# EAGLE design e4e_sleep_timer (EAGLE 9.6.2)

## Sheet 1 of 2
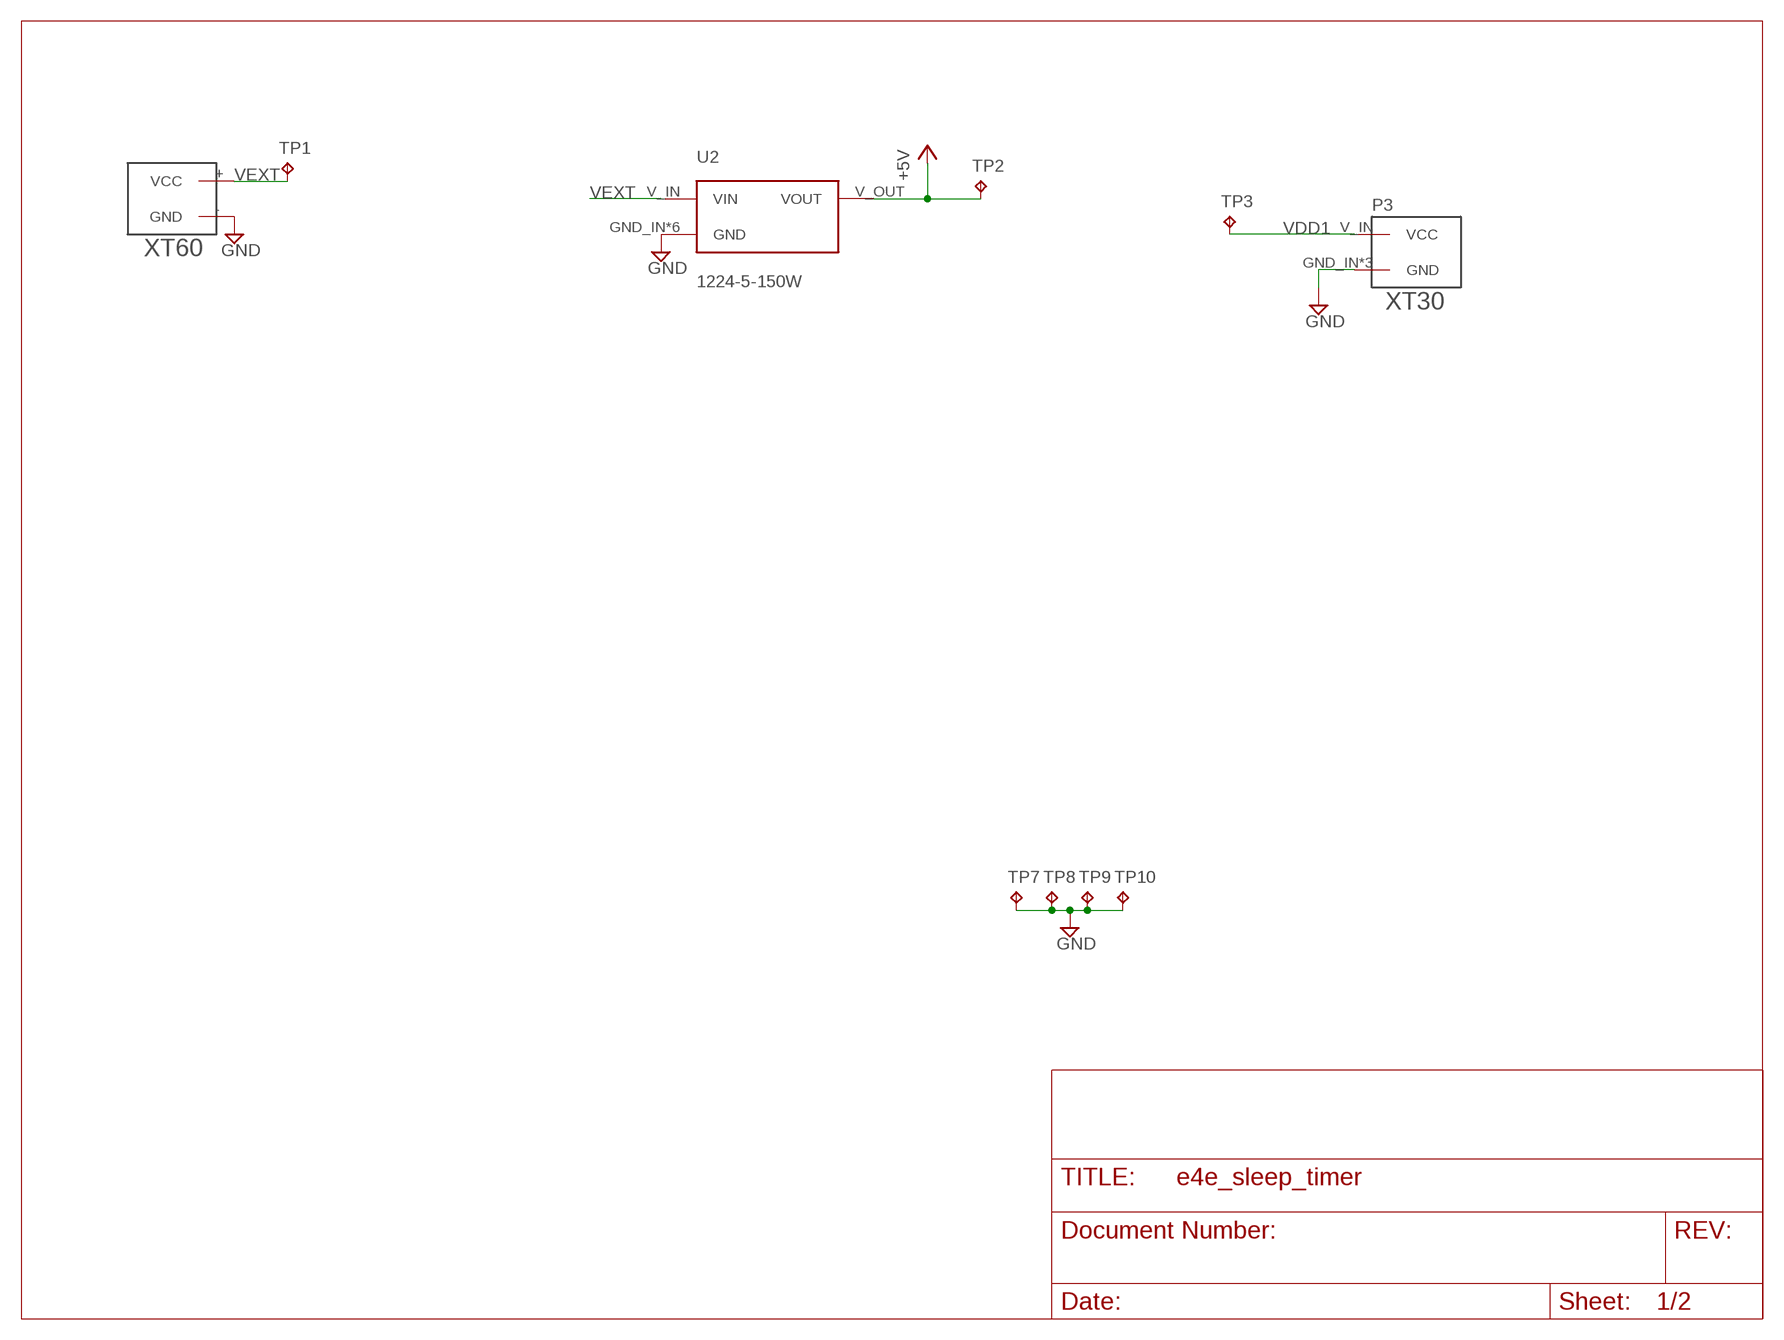
[diagram p0: schematic, sheet 1]

### Parts
P1  XT60  [XT60]
P3  XT30PW-F  [XT30PW-F]
TP1  TPPAD1-13  [P1-13]
TP2  TPPAD1-13  [P1-13]
TP3  TPPAD1-13  [P1-13]
TP7  TPPAD1-13  [P1-13]
TP8  TPPAD1-13  [P1-13]
TP9  TPPAD1-13  [P1-13]
TP10  TPPAD1-13  [P1-13]
U2  1224-5-150W  [2X_XT30]

### Nets
+5V: TP2.TP U2.V_OUT(VOUT) ; also sheet 2
GND: P1.-(GND) P3.GND_IN(GND) P3.S1(GND) P3.S2(GND) TP7.TP TP8.TP TP9.TP TP10.TP U2.GND_IN(GND) U2.GND_OUT(GND) U2.S1(GND) U2.S2(GND) U2.S3(GND) U2.S4(GND) ; also sheet 2
VDD1: P3.V_IN(VCC) TP3.TP ; also sheet 2
VEXT: P1.+(VCC) TP1.TP U2.V_IN(VIN)

## Sheet 2 of 2
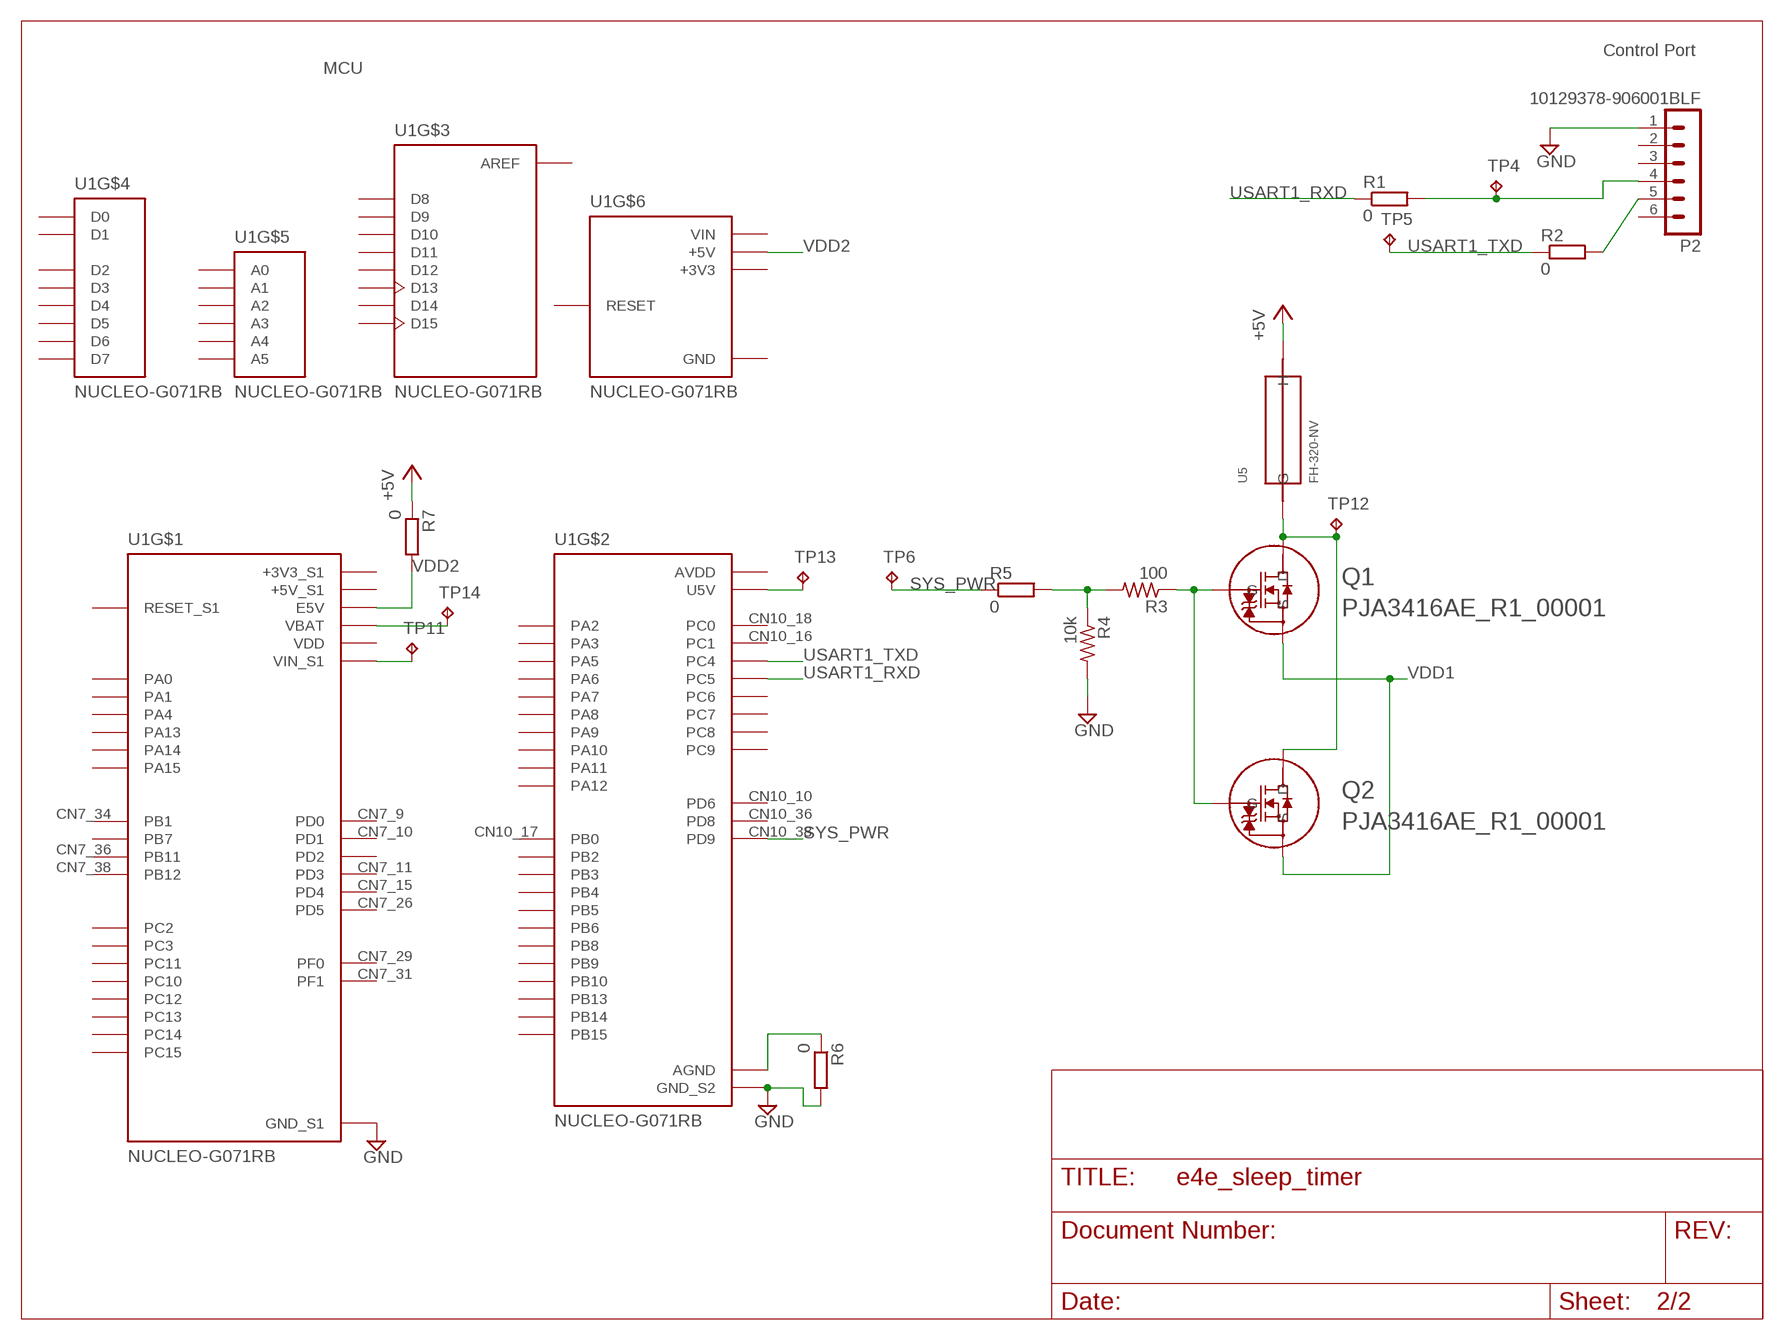
[diagram p1: schematic, sheet 2]

### Parts
P2  10129378-906001BLF  MA06-1  [MA06-1]
Q1  PJA3416AE_R1_00001  [SOT23_PJA3416_PNJ]
Q2  PJA3416AE_R1_00001  [SOT23_PJA3416_PNJ]
R1  0  R-EU_R0603  [R0603]
R2  0  R-EU_R0603  [R0603]
R3  100  R-US_R0603  [R0603]
R4  10k  R-US_R0603  [R0603]
R5  0  R-EU_R0603  [R0603]
R6  0  R-EU_R0603  [R0603]
R7  0  R-EU_R0603  [R0603]
TP4  TPPAD1-13  [P1-13]
TP5  TPPAD1-13  [P1-13]
TP6  TPPAD1-13  [P1-13]
TP11  TPTP20R  [TP20R]
TP12  TPTP20R  [TP20R]
TP13  TPTP20R  [TP20R]
TP14  TPTP20R  [TP20R]
U1  NUCLEO-G071RB  [ST_NUCLEO-64]
U5  FH-320-NV  [FH-320-NV]

### Nets
+5V: R7.1 U5.2(H) ; also sheet 1
GND: P2.1 R4.2 R6.2 U1.CN7_8(GND_S1) U1.CN7_19(GND_S1) U1.CN7_20(GND_S1) U1.CN7_22(GND_S1) U1.CN10_20(GND_S2) ; also sheet 1
N$1: P2.4 R1.2 TP4.TP
N$2: Q1.1(G) Q2.1(G) R3.1
N$3: P2.5 R2.2
N$4: R3.2 R4.1 R5.2
N$5: Q1.3(D) Q2.3(D) TP12.TP U5.1(G)
N$6: TP11.TP U1.CN7_24(VIN_S1)
N$7: R6.1 U1.CN10_9(AGND) U1.CN10_32(AGND)
N$8: TP13.TP U1.CN10_8(U5V)
N$9: TP14.TP U1.CN7_33(VBAT)
SYS_PWR: R5.1 TP6.TP U1.CN10_38(PD9)
USART1_RXD: R1.1 U1.CN10_37(PC5)
USART1_TXD: R2.1 TP5.TP U1.CN10_35(PC4)
VDD1: Q1.2(S) Q2.2(S) ; also sheet 1
VDD2: R7.2 U1.CN6_5(+5V) U1.CN7_6(E5V)
Unconnected: P2.2 P2.3 P2.6 U1.CN5_1(D8) U1.CN5_2(D9) U1.CN5_3(D10) U1.CN5_4(D11) U1.CN5_5(D12) U1.CN5_6(D13) U1.CN5_9(D14) U1.CN5_10(D15) U1.CN6_3(RESET) U1.CN7_1(PC10) U1.CN7_2(PC11) U1.CN7_3(PC12) U1.CN7_4(PD2) U1.CN7_7(PA14) U1.CN7_9(PD0) U1.CN7_10(PD1) U1.CN7_11(PD3) U1.CN7_13(PA13) U1.CN7_14(RESET_S1) U1.CN7_15(PD4) U1.CN7_17(PA15) U1.CN7_21(PB7) U1.CN7_23(PC13) U1.CN7_25(PC14) U1.CN7_26(PD5) U1.CN7_27(PC15) U1.CN7_28(PA0) U1.CN7_29(PF0) U1.CN7_30(PA1) U1.CN7_31(PF1) U1.CN7_32(PA4) U1.CN7_34(PB1) U1.CN7_35(PC2) U1.CN7_36(PB11) U1.CN7_37(PC3) U1.CN7_38(PB12) U1.CN8_1(A0) U1.CN8_2(A1) U1.CN8_3(A2) U1.CN8_4(A3) U1.CN8_5(A4) U1.CN8_6(A5) U1.CN9_1(D0) U1.CN9_2(D1) U1.CN9_3(D2) U1.CN9_4(D3) U1.CN9_5(D4) U1.CN9_6(D5) U1.CN9_7(D6) U1.CN9_8(D7) U1.CN10_1(PC9) U1.CN10_2(PC8) U1.CN10_3(PB8) U1.CN10_4(PC6) U1.CN10_5(PB9) U1.CN10_6(PA3) U1.CN10_10(PD6) U1.CN10_11(PA5) U1.CN10_12(PA12) U1.CN10_13(PA6) U1.CN10_14(PA11) U1.CN10_15(PA7) U1.CN10_16(PC1) U1.CN10_17(PB0) U1.CN10_18(PC0) U1.CN10_19(PC7) U1.CN10_21(PA9) U1.CN10_22(PB2) U1.CN10_23(PA8) U1.CN10_24(PB6) U1.CN10_25(PB14) U1.CN10_26(PB15) U1.CN10_27(PB4) U1.CN10_28(PB10) U1.CN10_29(PB5) U1.CN10_30(PB13) U1.CN10_31(PB3) U1.CN10_33(PA10) U1.CN10_34(PA2) U1.CN10_36(PD8)

### Notes on the sheet
- Control Port
- MCU

## Power pins joined to a net without a drawn wire
+3V3: U1.CN6_2(+3V3) U1.CN6_4(+3V3)
+3V3_S1: U1.CN7_12(+3V3_S1) U1.CN7_16(+3V3_S1)
+5V_S1: U1.CN7_18(+5V_S1)
AREF: U1.CN5_8(AREF)
AVDD: U1.CN10_7(AVDD)
GND: U1.CN6_6(GND) U1.CN6_7(GND)
VDD: U1.CN7_5(VDD)
VIN: U1.CN6_1(VIN)

## Library data of the parts
P1 = XT60:XT60: XT60
P2 = con-lstb:MA06-1: PIN HEADER; OC_FARNELL: unknown; OC_NEWARK: unknown
P3 = XT60:XT30PW-F: https://www.gobilda.com/right-angle-pcb-mount-xt30-connector-mh-fc-2-pack/
Q1 Q2 = PJA3416AE_R1_00001:PJA3416AE_R1_00001; COPYRIGHT: Copyright (C) 2022 Ultra Librarian. All rights reserved.; DIGI-KEY_PART_NUMBER_1: 3757-PJA3416AE_R1_00001TR-ND; DIGI-KEY_PART_NUMBER_2: 3757-PJA3416AE_R1_00001CT-ND; DIGI-KEY_PART_NUMBER_3: 3757-PJA3416AE_R1_00001DKR-ND; MANUFACTURER_PART_NUMBER: PJA3416AE_R1_00001; MFR_NAME: Panjit
R1 R2 R5-R7 = rcl:R-EU_: RESISTOR, European symbol; SPICEPREFIX: R
R3 R4 = rcl:R-US_: RESISTOR, American symbol; SPICEPREFIX: R
TP1-TP14 = testpad:TP: Test pad
U1 = NUCLEO-F401RE:NUCLEO-G071RB: STM32 Nucleo-64 development board with STM32F401RET6 MCU, supports Arduino and ST morpho connectivity Check availability <https://pricing.snapeda.com/parts/NUCLEO-F401RE/STMicroelectronics/view-part?ref=eda>; AVAILABILITY: In Stock; DESCRIPTION: STM32F401RE, mbed-Enabled Development Nucleo-64 STM32F4 ARM® Cortex®-M4 MCU 32-Bit Embedded Evaluation Board; MF: STMicroelectronics; MP: NUCLEO-F401RE; PACKAGE: None; PRICE: None; PURCHASE-URL: https://pricing.snapeda.com/search/part/NUCLEO-F401RE/?ref=eda
U2 = KNACRO_Regulator:1224-5-150W
U5 = fuses:FH-320-NV

## Board
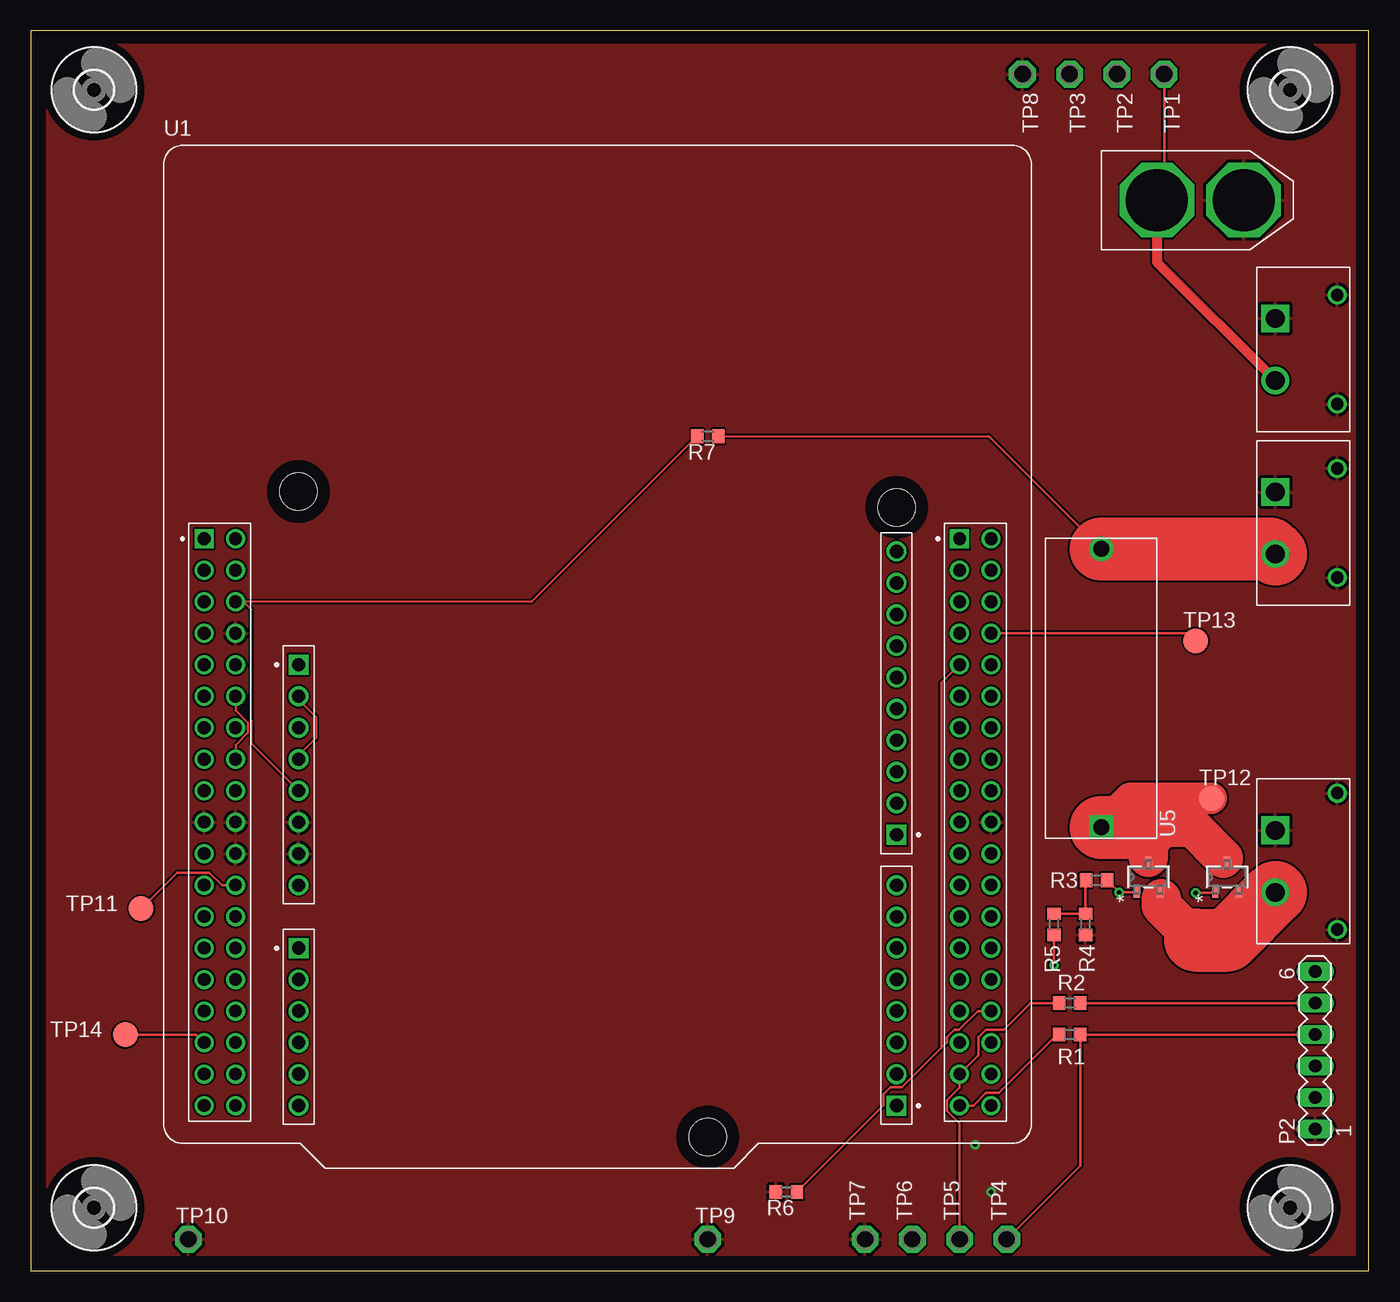
[diagram p2: board, top side]
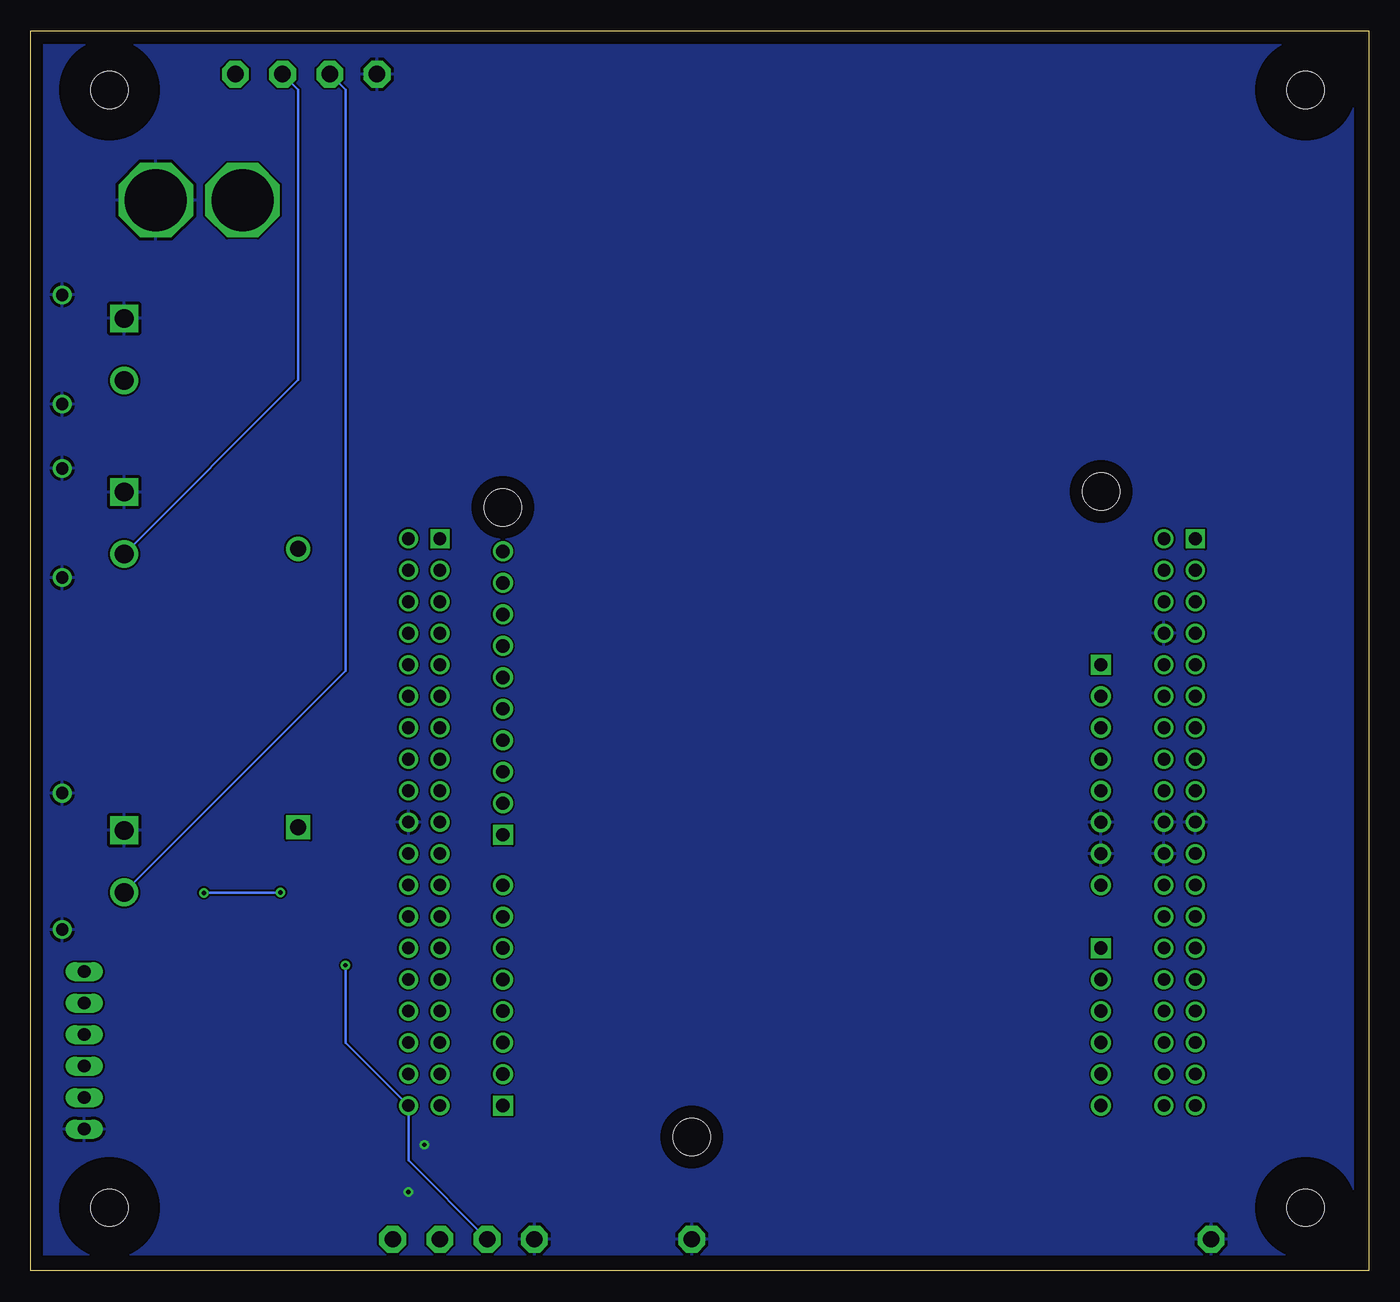
[diagram p3: board, bottom side, seen from below]

Size 107.93 x 100 mm. Coordinates in mm from the lower left corner, seen from the top.
Outline: 0,0 107.93,0 107.93,100 0,100 0,0
Copper layers (1*16): Top 0.035mm / dielectric 1.5mm / Bottom 0.035mm
Design rules "default": minimum track width 6mil, minimum drill 0.35mm, track to track 6mil, track to pad 6mil, pad to pad 6mil, via to via 6mil, smd to smd 6mil, copper to edge 40mil, drill to drill 6mil, minimum pad ring 10mil, minimum via ring 8mil, stop-mask expansion 4mil, vias tented up to drill 0mil, thermal gap 10mil

### Footprints (pad centres in the part's own frame; a part is rotated, then mirrored left to right if it is on the bottom)
XT60 = drill 5 octagon: + 4.5,0; - 11.5,0
MA06-1 = drill 1.016 long: 1 -6.35,0; 2 -3.81,0; 3 -1.27,0; 4 1.27,0; 5 3.81,0; 6 6.35,0
XT30PW-F = drill 1.5 square: GND_IN -5,2.5 | drill 1: S1 0,5.5; S2 0,-5.5 | drill 1.5: V_IN -5,-2.5
SOT23_PJA3416_PNJ = smd 0.864 x 0.508: 1 -1.232,0.95; 2 -1.232,-0.95; 3 1.232,0
R0603 = smd 1 x 1.1: 1 -0.85,0; 2 0.85,0
P1-13 = drill 1.321 pad 2.159 octagon: TP 0,0
TP20R = smd 2 x 2: TP 0,0
ST_NUCLEO-64 = drill 1.07 square: CN5_1 24.13,-14.37; CN6_1 -24.13,-0.65; CN8_1 -24.13,-23.51; CN9_1 24.13,-36.21 | drill 1.07: CN5_2 24.13,-11.83; CN5_3 24.13,-9.29; CN5_4 24.13,-6.75; CN5_5 24.13,-4.21; CN5_6 24.13,-1.67; CN5_7 24.13,0.87; CN5_8 24.13,3.41; CN5_9 24.13,5.95; CN5_10 24.13,8.49; CN6_2 -24.13,-3.19; CN6_3 -24.13,-5.73; CN6_4 -24.13,-8.27; CN6_5 -24.13,-10.81; CN6_6 -24.13,-13.35; CN6_7 -24.13,-15.89; CN6_8 -24.13,-18.43; CN8_2 -24.13,-26.05; CN8_3 -24.13,-28.59; CN8_4 -24.13,-31.13; CN8_5 -24.13,-33.67; CN8_6 -24.13,-36.21; CN9_2 24.13,-33.67; CN9_3 24.13,-31.13; CN9_4 24.13,-28.59; CN9_5 24.13,-26.05; CN9_6 24.13,-23.51; CN9_7 24.13,-20.97; CN9_8 24.13,-18.43 | drill 1.02 square: CN7_1 -31.75,9.51; CN10_1 29.21,9.51 | drill 1.02: CN7_2 -29.21,9.51; CN7_3 -31.75,6.97; CN7_4 -29.21,6.97; CN7_5 -31.75,4.43; CN7_6 -29.21,4.43; CN7_7 -31.75,1.89; CN7_8 -29.21,1.89; CN7_9 -31.75,-0.65; CN7_10 -29.21,-0.65; CN7_11 -31.75,-3.19; CN7_12 -29.21,-3.19; CN7_13 -31.75,-5.73; CN7_14 -29.21,-5.73; CN7_15 -31.75,-8.27; CN7_16 -29.21,-8.27; CN7_17 -31.75,-10.81; CN7_18 -29.21,-10.81; CN7_19 -31.75,-13.35; CN7_20 -29.21,-13.35; CN7_21 -31.75,-15.89; CN7_22 -29.21,-15.89; CN7_23 -31.75,-18.43; CN7_24 -29.21,-18.43; CN7_25 -31.75,-20.97; CN7_26 -29.21,-20.97; CN7_27 -31.75,-23.51; CN7_28 -29.21,-23.51; CN7_29 -31.75,-26.05; CN7_30 -29.21,-26.05; CN7_31 -31.75,-28.59; CN7_32 -29.21,-28.59; CN7_33 -31.75,-31.13; CN7_34 -29.21,-31.13; CN7_35 -31.75,-33.67; CN7_36 -29.21,-33.67; CN7_37 -31.75,-36.21; CN7_38 -29.21,-36.21; CN10_2 31.75,9.51; CN10_3 29.21,6.97; CN10_4 31.75,6.97; CN10_5 29.21,4.43; CN10_6 31.75,4.43; CN10_7 29.21,1.89; CN10_8 31.75,1.89; CN10_9 29.21,-0.65; CN10_10 31.75,-0.65; CN10_11 29.21,-3.19; CN10_12 31.75,-3.19; CN10_13 29.21,-5.73; CN10_14 31.75,-5.73; CN10_15 29.21,-8.27; CN10_16 31.75,-8.27; CN10_17 29.21,-10.81; CN10_18 31.75,-10.81; CN10_19 29.21,-13.35; CN10_20 31.75,-13.35; CN10_21 29.21,-15.89; CN10_22 31.75,-15.89; CN10_23 29.21,-18.43; CN10_24 31.75,-18.43; CN10_25 29.21,-20.97; CN10_26 31.75,-20.97; CN10_27 29.21,-23.51; CN10_28 31.75,-23.51; CN10_29 29.21,-26.05; CN10_30 31.75,-26.05; CN10_31 29.21,-28.59; CN10_32 31.75,-28.59; CN10_33 29.21,-31.13; CN10_34 31.75,-31.13; CN10_35 29.21,-33.67; CN10_36 31.75,-33.67; CN10_37 29.21,-36.21; CN10_38 31.75,-36.21 | hole 3: 8.89,-38.75; 24.13,12.05; -24.13,13.32
2X_XT30 = drill 1.5 square: GND_IN -5,9.5; GND_OUT -5,-4.5 | drill 1: S1 0,11.4; S2 0,2.6; S3 0,-2.6; S4 0,-11.4 | drill 1.5: V_IN -5,4.5; V_OUT -5,-9.5
FH-320-NV = drill 1.3 square: 1 -11.23,0 | drill 1.3: 2 11.23,0
3,0 = hole 3: 0,0

### Placement (x,y rotation side)
P1  86.36,86.36 0 top
P2  103.63,17.78 90 top
P3  105.41,33.02 0 top
Q1  90.17,31.75 90 top
Q2  96.52,31.75 90 top
R1  83.82,19.05 0 top
R2  83.82,21.59 0 top
R3  85.98,31.5 180 top
R4  85.09,27.94 270 top
R5  82.55,27.94 90 top
R6  60.96,6.35 180 top
R7  54.61,67.31 180 top
TP1  91.44,96.52 0 top
TP2  87.63,96.52 0 top
TP3  83.82,96.52 0 top
TP4  78.74,2.54 0 top
TP5  74.93,2.54 0 top
TP6  71.12,2.54 0 top
TP7  67.31,2.54 0 top
TP8  80.01,96.52 0 top
TP9  54.61,2.54 0 top
TP10  12.7,2.54 0 top
TP11  8.89,29.21 0 top
TP12  95.25,38.1 0 top
TP13  93.98,50.8 0 top
TP14  7.62,19.05 0 top
U1  45.72,49.53 0 top
U2  105.41,67.31 0 top
U5  86.36,46.99 90 top
U$1  [3,0]  5.08,5.08 0 top
U$2  [3,0]  5.08,95.25 0 top
U$3  [3,0]  101.6,95.25 0 top
U$4  [3,0]  101.6,5.08 0 top

### Tracks (layer width: path | path; a pad name or v marks a point on that pad's centre or on a via)
+3V3
  Top 0.152: U1.CN6_4 21.64,41.3 21.64,41.6 23.01,42.98 23.01,44.65 21.64,46.02 21.64,46.33 U1.CN6_2
+3V3_S1
  Top 0.152: U1.CN7_12 16.51,45.2 17.5,44.21 17.5,43.39 16.51,42.4 U1.CN7_16
+5V
  Top 0.152: R7.1 77.27,67.31
  Top 0.203: U5.2 77.37,67.21 77.27,67.31
  Top 5.08: U5.2 100,58.22 U2.V_OUT
  Bottom 0.203: U2.V_OUT 86.36,71.86 86.36,95.25 TP2.TP
GND  (via drill 0.35)
  other vias: 76.2,10.16 77.47,6.35
  pour Top: 1.27,99.06 1.27,1.27 158.75,1.27 158.75,99.06
  pour Bottom: 1.27,99.06 1.27,1.27 158.75,1.27 158.75,99.06
N$1
  Top 0.203: P2.4 R1.2 84.67,8.47 TP4.TP
N$2  (via drill 0.35)
  Top 0.203: R3.1 v87.81,30.52 Q1.1 | Q2.1 95.53,30.48 v93.98,30.48
  Bottom 0.203: v93.98,30.48 87.84,30.48 v87.81,30.52
N$3
  Top 0.203: R2.2 P2.5
N$4
  Top 0.203: R5.2 R4.1 85.09,31.22 R3.2
N$5
  Top 0.203: 96.52,33.21 Q2.3 96.23,33.27 | Q1.3 90.17,33.34
  Top 2.54: U5.1 88.7,38.1 TP12.TP
  Top 3.175: 90.04,35.81 90.17,35.69 90.17,33.34 | 89.99,35.76 93.74,35.76 96.23,33.27
  Top 5.08: U5.1 89.99,35.76 90.04,35.81
N$6
  Top 0.203: U1.CN7_24 15.41,31.1 14.39,32.12 11.8,32.12 TP11.TP
N$7
  Top 0.203: U1.CN10_32 76.4,20.94 74.88,19.42 74.51,19.42 73.91,18.82 73.91,18.43 73.46,17.98 | R6.1 68.79,13.33 68.79,14.23 69.37,14.8 70.29,14.8 73.46,17.98 | U1.CN10_9 73.46,47.41 73.46,17.98
N$8
  Top 0.203: U1.CN10_8 93.36,51.42 TP13.TP
N$9
  Top 0.203: U1.CN7_33 13.32,19.05 TP14.TP
SYS_PWR  (via drill 0.35)
  Top 0.203: R5.1 v82.55,24.64
  Bottom 0.203: TP6.TP 77.47,8.89 U1.CN10_38 82.55,18.4 v82.55,24.64
USART1_RXD
  Top 0.152: 82.86,19.1 R1.1
  Top 0.203: U1.CN10_37 76.03,13.32 77.05,14.34 78.09,14.34 82.86,19.1
USART1_TXD
  Top 0.203: R2.1 80.66,21.59 78.49,19.42 77.05,19.42 76.45,18.82 76.45,17.38 U1.CN10_35 74.93,14.76 73.91,13.74 73.91,12.9 74.93,11.88 TP5.TP
VDD1
  Top 0.203: P3.V_IN Q2.2 | Q1.2 91.21,30.42 91.21,29.44
  Top 3.175: 93.98,26.67 91.21,29.44 91.21,30.01
  Top 5.08: 93.98,26.67 96.56,26.67 P3.V_IN
  Bottom 0.203: P3.V_IN 82.55,48.38 82.55,95.25 TP3.TP
VDD2
  Top 0.152: U1.CN6_5 17.81,42.5 17.81,44.34 17.78,44.37 17.78,53.34 17.16,53.96 U1.CN7_6 40.41,53.96 R7.2
VEXT
  Top 0.203: TP1.TP 91.44,86.94 P1.+
  Top 0.813: P1.+ 90.86,81.36 U2.V_IN

### Text on the board
tDocu: Sleep Timer Board | REV A